# Altium schematic sheet CS IC.SchDoc
size A
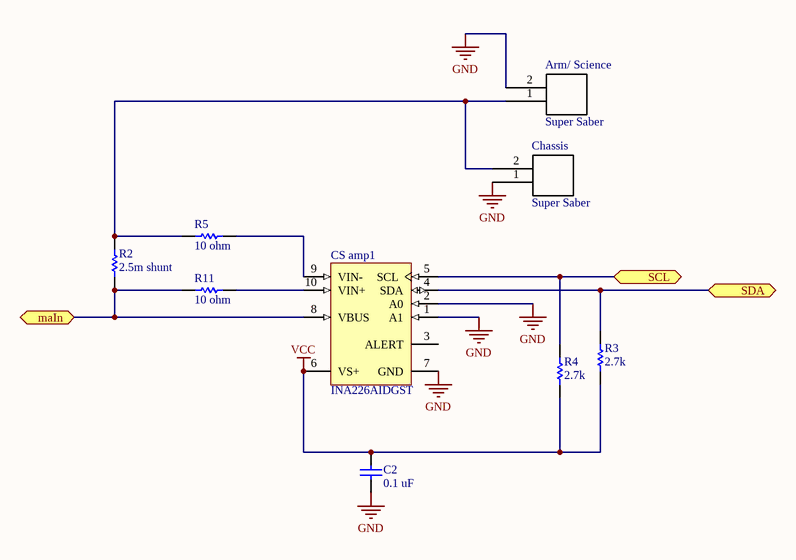
[diagram p0: CS IC.SchDoc]

## Parts
Arm/_Science  Super Saber  [0431600102]
C2  0.1 uF  [CAPC0805(2012)130_N]
Chassis  Super Saber  [0431600102]
CS_amp1  INA226AIDGST  [DGS0010A_N]
R2  2.5m shunt  [RESC0805(2012)_N]
R3  2.7k  [RESC0805(2012)_N]
R4  2.7k  [RESC0805(2012)_N]
R5  10 ohm  [RESC0805(2012)_N]
R11  10 ohm  [RESC0805(2012)_N]

## Ports
maIn (bidir), SCL (bidir), SDA (bidir)

## Nets
GND: Arm/_Science.2 C2.1 Chassis.1 CS_amp1.1(A1) CS_amp1.2(A0) CS_amp1.7(GND)
VCC: C2.2 CS_amp1.6(VS+) R3.1 R4.1
maIn: CS_amp1.8(VBUS) R2.1 R11.2 ; port maIn
SCL: CS_amp1.5(SCL) R4.2 ; port SCL
SDA: CS_amp1.4(SDA) R3.2 ; port SDA
NetArm/_Science_1: Arm/_Science.1 Chassis.2 R2.2 R5.2
NetCS_amp1_9: CS_amp1.9(VIN-) R5.1
NetCS_amp1_10: CS_amp1.10(VIN+) R11.1

Not connected (* = marked no-connect by the designer): CS_amp1 3(ALERT)

## Library data of the parts
C2 = CMP-1036-02603-1: CAP 390pF 200V ±5% 0805 (2012 Metric) Thickness 1.3mm SMD; Case-Metric: 2012; Case-EIA: 0805; Tolerance: Â±5%; Max Thickness: 1.3 mm; Rated Voltage: 200 V; Technology: SMT; Value: 390pF
CS_amp1 = CMP-0704-00057-2: High-Side Measurement, Bi-Directional Current / Power Monitor with I2C Interface, 2.7 to 5.5 V, -40 to 125 degC, 10-pin SOP (DGS10), Green (RoHS & no Sb/Br); Quiescent Current (+/-)(Typ)(mA): 0.33; Common Mode Range(Max)(V): 36; Input Offset (+/-)(Max)(uV): 10; Vs(Min)(V): 2.7; Common Mode Range(Min)(V): 0; Rating: Catalog; CMRR(Min)(dB): 126; Input Offset Drift (+/-)(Max)(uV/Degrees Celsius): 0.1; SubFamily: Current Shunt Monitor; Small-Signal Bandwidth(Typ)(MHz): 0.007; Gain(V/V): 1; Vs(Max)(V): 5.5; PartNumber: INA226AIDGST; ComponentLink3Description: Package Specification; ComponentLink3URL: http://www.ti.com/lit/ml/mpds035b/mpds035b.pdf; PackageReference: DGS0010A; Mounting Technology: Surface Mount; ComponentLink2URL: http://www.ti.com/general/docs/lit/getliterature.tsp?genericPartNumber=INA226&fileType=pdf; ComponentLink1URL: http://www.ti.com/; Code_JEDEC: MO-153; Eco-Plan: Green (RoHS & no Sb/Br); DatasheetVersion: SBOS547; PackageDescription: 10-Pin Plastic Small Outline, Body 3 x 3 mm, Pitch 0.5 mm; ComponentLink2Description: Datasheet; ComponentLink1Description: Manufacturer URL; PackageVersion: 4073272/C, 02/2004
R2 = CMP-1013-00418-1: SR32L500FE66; Case-Metric: 2012; Case-EIA: 0805; Value: 160.00 Ohm; Tolerance: 1 %; Power: 0.125 W; Technology: SMT; ComponentLink1Description: datasheet; ComponentLink1URL: http://www.vishay.com/docs/31067/sr.pdfhttp://www.vishay.com/docs/31067/sr.pdfhttp://www.vishay.com/docs/31067/sr.pdf; ComponentLink2Description: purchase link; ComponentLink2URL: https://www.digikey.com/product-detail/en/vishay-dale/SR32L500FE66/541-3933-ND/7560303
R3-R5 R11 = CMP-1013-00418-1: 160R 0.125W 1% 0805 (2012 Metric)  SMD; Case-Metric: 2012; Case-EIA: 0805; Value: 160.00 Ohm; Technology: SMT; Tolerance: 1 %; Power: 0.125 W
  R3 R4: ComponentLink1Description: calc; ComponentLink1URL: http://www.ti.com/lit/an/slva689/slva689.pdf